# Altium schematic sheet Connectors.SchDoc
size A4; SheetNumber: 5; SheetTotal: 7
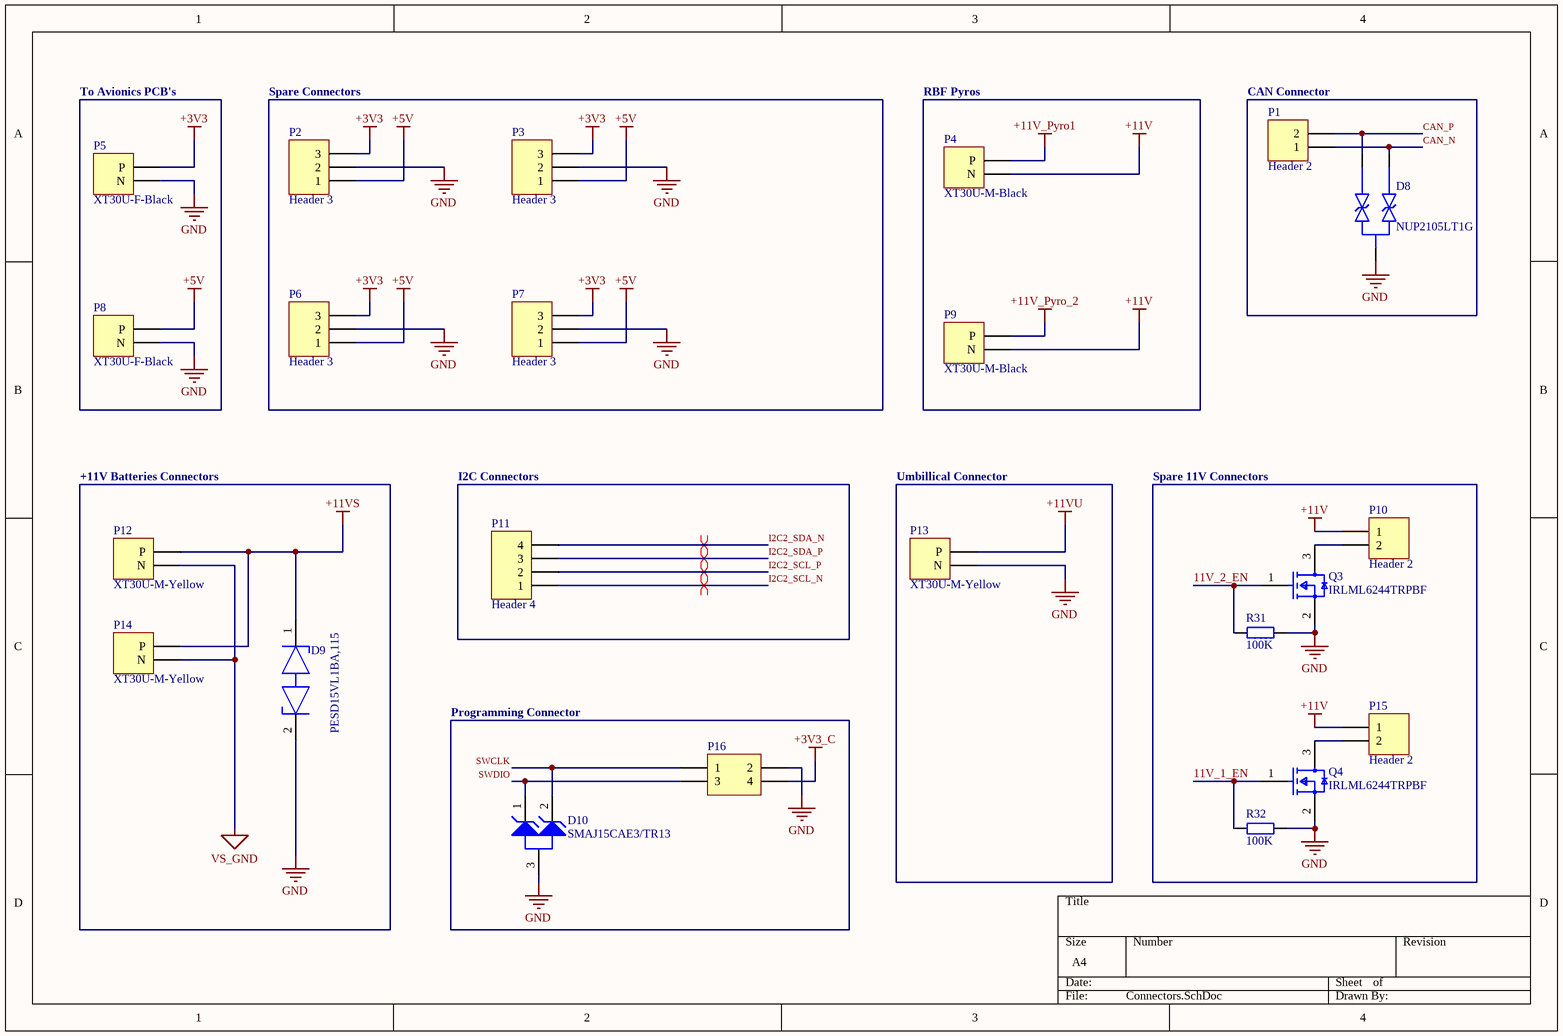
[diagram p0: Connectors.SchDoc]

## Parts
D8  NUP2105LT1G  [NUP2105LT1G-Footprint-1]
D9  PESD15VL1BA,115  [FP-SOD323-CA-IPC_C]
D10  SMAJ15CAE3/TR13  [ONSC-SOT-723-3-631AA-01_V]
P1  Header 2  [JST XH 2]
P2  Header 3  [JST XH 3]
P3  Header 3  [JST XH 3]
P4  XT30U-M-Black  [XT30-Footprint-2]
P5  XT30U-F-Black  [XT30-Footprint-1]
P6  Header 3  [JST XH 3]
P7  Header 3  [JST XH 3]
P8  XT30U-F-Black  [XT30-F Negro]
P9  XT30U-M-Black  [XT30-Footprint-2]
P10  Header 2  [JST XH 2]
P11  Header 4  [JST XH]
P12  XT30U-M-Yellow  [XT30-Footprint-2]
P13  XT30U-M-Yellow  [XT30-Footprint-2]
P14  XT30U-M-Yellow  [XT30-Footprint-2]
P15  Header 2  [JST XH 2]
P16  2 Row 2.54mm Pin Header  [My_2X02]  (value not drawn)
Q3  IRLML6244TRPBF  [FP-Micro3-IPC_C]
Q4  IRLML6244TRPBF  [FP-Micro3-IPC_C]
R31  100K  [R0603-0.45]
R32  100K  [R0603-0.45]

## Blocks framed on the sheet
To Avionics PCB's: P5 P8
Spare Connectors: P2 P3 P6 P7
RBF Pyros: P4 P9
CAN Connector: D8 P1
+11V Batteries Connectors: D9 P12 P14
I2C Connectors: P11
Umbillical Connector: P13
Spare 11V Connectors: P10 P15 Q3 Q4 R31 R32
Programming Connector: D10 P16

## Nets
+3V3: P2.3 P3.3 P5.P P6.3 P7.3
+3V3_C: P16.4
+5V: P2.1 P3.1 P6.1 P7.1 P8.P
+11V: P4.N P9.N P10.1 P15.1
+11V_Pyro1: P4.P
+11V_Pyro_2: P9.P
+11VS: D9.1 P12.P P14.P
+11VU: P13.P
GND: D8.3 D9.2 D10.3(A) P2.2 P3.2 P5.N P6.2 P7.2 P8.N P13.N P16.2 Q3.2(S) Q4.2(S) R31.2 R32.2
VS_GND: P12.N P14.N
11V_1_EN: Q4.1(G) R32.1
11V_2_EN: Q3.1(G) R31.1
CAN_N: D8.1 P1.1
CAN_P: D8.2 P1.2
I2C2_SCL_N: P11.1
I2C2_SCL_P: P11.2
I2C2_SDA_N: P11.4
I2C2_SDA_P: P11.3
SWCLK: D10.2(K2) P16.1
SWDIO: D10.1(K1) P16.3
NetP10_2: P10.2 Q3.3(D)
NetP15_2: P15.2 Q4.3(D)

## Layout directives
differential pair: I2C2_SCL_N, I2C2_SCL_P, I2C2_SDA_N, I2C2_SDA_P

## Library data of the parts
D8 = CMP-004-00006-2: Supresor de ESD / diodos TVS 27V CAN BUS Protection; Manufacturer: Onsemi; Manufacturer Part Number: NUP2105LT1G; Case/Package: None; Pins: 3
D9 = CMP-14432-000007-1: TVS DIODE 15VWM 44VC SOD323; Manufacturer: Nexperia; Manufacturer Part Number: PESD15VL1BA,115
D10 = CMP-004-00007-1: Supresores de ESD / diodos TVS TVS 400W, Stand-off voltage = 15V, +/- 5%, Bi-dir; Manufacturer: Micochip Technology; Manufacturer Part Number: SMAJ15CAE3/TR13
P1 P10 P15 = CMP-016-000011-6: Header, 2-Pin; ASiD Part Number: Header 2-AS; Signal Integrity: Connector; Design Item ID: Header 2; Pin Count: 2; Component Type: Standard; Source: PCB_Project1.SCHLIB
P2 P3 P6 P7 = CMP-016-000017-5: Header, 3-Pin; ASiD Part Number: Header 3-AS; Signal Integrity: Connector; Pin Count: 3; Design Item ID: Header 3; Component Type: Standard; Source: PCB_Project1.SCHLIB
P4 P8 P9 = CMP-002-00004-11: XT30PW-M公头 Socket,DCsupply,XT30,male,PIN:2; Manufacturer: AMASS
  P4 P9: Manufacturer Part Number: XT30U-M-Black
  P8: Manufacturer Part Number: XT30U-F-Black
P5 = CMP-002-00004-7: XT30PW-M公头 Socket,DCsupply,XT30,male,PIN:2; Manufacturer: AMASS; Manufacturer Part Number: XT30U-F-Yellow
P11 = CMP-016-000019-4: Header, 4-Pin; ASiD Part Number: Header 4-AS; Signal Integrity: Connector; Design Item ID: Header 4; Source: PCB_Project1.SCHLIB; Pin Count: 4; Component Type: Standard
P12-P14 = CMP-002-00004-7: XT30PW-M公头 Socket,DCsupply,XT30,male,PIN:2; Manufacturer: AMASS; Manufacturer Part Number: XT30U-M-Yellow
P16 = CMP-016-000016-1: Header, 2-Pin, Dual row; Manufacturer: *; Manufacturer Part Number: *
Q3 Q4 = CMP-013-00010-1: Power Field-Effect Transistor, 6.3A I(D), 20V, 0.021ohm, 1-Element, N-Channel, Silicon, Metal-oxide Semiconductor FET, TO-236AB; RoHS Compliant: Yes; Max Operating Temperature: 150°C; Pins: 3
R31 R32 = R: Resistor, 100K, 0603, 0.1W; Manufacturer: Wurth; Manufacturer Part Number: 560112116004; Power Disipation: 0.1W; ClassName: REG5V